# Altium schematic sheet MCU.SchDoc
size Legal; CompanyName: Ploopy Corporation; Organization: Ploopy Corporation; Address1: 137-1140 Burnhamthorpe Road W; Address2: Mississauga; Address3: Ontario; Address4: Canada L5C 0A3; DocumentNumber: 3; Revision: R1.001; SheetNumber: 3; SheetTotal: 5
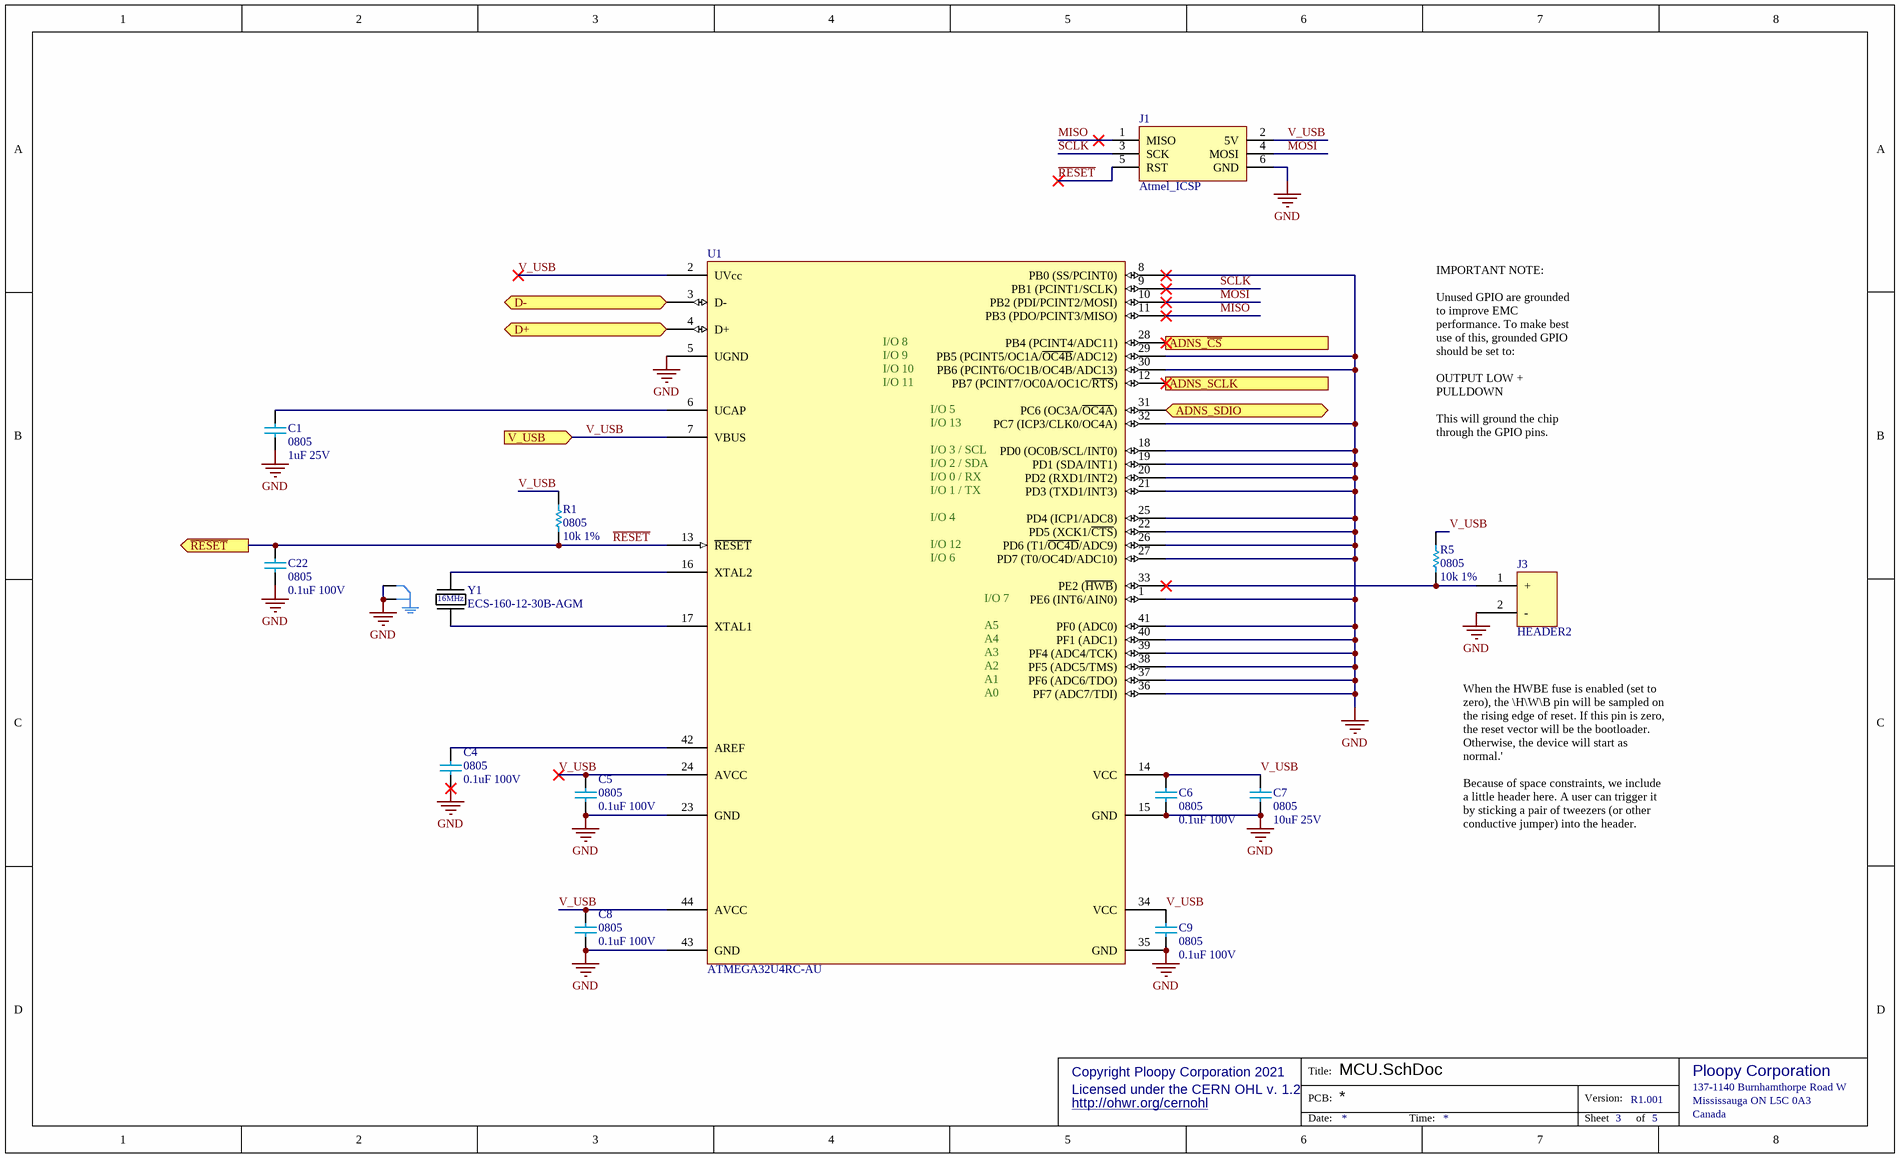
[diagram p0: MCU.SchDoc]

## Parts
C1  0805  value 1uF 25V  [0805 - TALL]
C4  0805  value 0.1uF 100V  [0805 - TALL]
C5  0805  value 0.1uF 100V  [0805 - TALL]
C6  0805  value 0.1uF 100V  [0805 - TALL]
C7  0805  value 10uF 25V  [0805 - TALL]
C8  0805  value 0.1uF 100V  [0805 - TALL]
C9  0805  value 0.1uF 100V  [0805 - TALL]
C22  0805  value 0.1uF 100V  [0805 - TALL]
J1  Atmel_ICSP  [6x2]
J3  HEADER2  [2x1]
R1  0805  value 10k 1%  [0805]
R5  0805  value 10k 1%  [0805]
U1  ATMEGA32U4RC-AU  [ATmega32U4 - TQFP80P1200X1200X120-44N]
Y1  ECS-160-12-30B-AGM  [LFXTAL055663BULK]

## Ports
ADNS_SCLK (out), ADNS_SDIO (bidir), ADNS_~{CS} (out), D+ (bidir), D- (bidir), V_USB (in), ~{RESET} (out)

## Nets
GND: C1.1 C4.1 C5.1 C6.1 C7.1 C8.1 C9.1 C22.1 J1.6(GND) J3.2(-) U1.1(PE6_(INT6/AIN0)) U1.5(UGND) U1.8(PB0_(SS/PCINT0)) U1.15(GND) U1.18(PD0_(OC0B/SCL/INT0)) U1.19(PD1_(SDA/INT1)) U1.20(PD2_(RXD1/INT2)) U1.21(PD3_(TXD1/INT3)) U1.22(PD5_(XCK1/~{CTS})) U1.23(GND) U1.25(PD4_(ICP1/ADC8)) U1.26(PD6_(T1/~{OC4D}/ADC9)) U1.27(PD7_(T0/OC4D/ADC10)) U1.29(PB5_(PCINT5/OC1A/~{OC4B}/ADC12)) U1.30(PB6_(PCINT6/OC1B/OC4B/ADC13)) U1.32(PC7_(ICP3/CLK0/OC4A)) U1.35(GND) U1.36(PF7_(ADC7/TDI)) U1.37(PF6_(ADC6/TDO)) U1.38(PF5_(ADC5/TMS)) U1.39(PF4_(ADC4/TCK)) U1.40(PF1_(ADC1)) U1.41(PF0_(ADC0)) U1.43(GND) Y1.2 Y1.4
ADNS_~{CS}: U1.28(PB4_(PCINT4/ADC11)) ; port ADNS_~{CS}
ADNS_SCLK: U1.12(PB7_(PCINT7/OC0A/OC1C/~{RTS})) ; port ADNS_SCLK
ADNS_SDIO: U1.31(PC6_(OC3A/~{OC4A})) ; port ADNS_SDIO
D+: U1.4(D+) ; port D+
D-: U1.3(D-) ; port D-
MISO: J1.1(MISO) U1.11(PB3_(PDO/PCINT3/MISO))
MOSI: J1.4(MOSI) U1.10(PB2_(PDI/PCINT2/MOSI))
~{RESET}: C22.2 J1.5(RST) R1.1 U1.13(~{RESET}) ; port ~{RESET}
SCLK: J1.3(SCK) U1.9(PB1_(PCINT1/SCLK))
V_USB: C5.2 C6.2 C7.2 C8.2 C9.2 J1.2(5V) R1.2 R5.2 U1.2(UVcc) U1.7(VBUS) U1.14(VCC) U1.24(AVCC) U1.34(VCC) U1.44(AVCC) ; port V_USB
NetC1_2: C1.2 U1.6(UCAP)
NetC4_2: C4.2 U1.42(AREF)
NetJ3_1: J3.1(+) R5.1 U1.33(PE2_(~{HWB}))
NetU1_16: U1.16(XTAL2) Y1.1
NetU1_17: U1.17(XTAL1) Y1.3

## Notes on the sheet
- IMPORTANT NOTE:
  Unused GPIO are grounded to improve EMC performance. To make best use of this, grounded GPIO should be set to:
  OUTPUT LOW + PULLDOWN
  This will ground the chip through the GPIO pins.
- When the HWBE fuse is enabled (set to zero), the \H\W\B pin will be sampled on the rising edge of reset. If this pin is zero, the reset vector will be the bootloader. Otherwise, the device will start as normal.'
  Because of space constraints, we include a little header here. A user can trigger it by sticking a pair of tweezers (or other conductive jumper) into the header.
- Copyright Ploopy Corporation 2021
- Licensed under the CERN OHL v. 1.2
- http://ohwr.org/cernohl
- Title:
- PCB:
- Version:
- Ploopy Corporation
- Mississauga ON L5C 0A3
- 137-1140 Burnhamthorpe Road W
- Date:
- Time:
- Sheet
- of
- Canada
- (in symbol ATMEGA32U4RC-AU) I/O 8; I/O 9; I/O 10; I/O 11; I/O 5; I/O 13; I/O 3 / SCL; I/O 2 / SDA; I/O 0 / RX; I/O 1 / TX; I/O 4; I/O 12; I/O 6; I/O 7; A5; A4; A3; A2; A1; A0
- (in symbol ECS-160-12-30B-AGM) 16MHz

## Library data of the parts
C1 = Cap 1uF 25V: 0805, X5R or better; Supplier 1: Digi-Key; Supplier Part Number 1: 1276-1066-2-ND; Supplier 2: Digi-Key; Supplier Part Number 2: 1276-1066-1-ND
C4-C6 C8 C9 C22 = Cap 0.1uF 100V: 0805, X5R or better; Supplier 1: Digi-Key; Supplier Part Number 1: 1276-6840-2-ND
C7 = Cap 10uF 25V: 0805, X5R or better; Supplier 1: Mouser; Supplier Part Number 1: 81-GRM21BR61E106KA3L; Supplier 2: Digi-Key; Supplier Part Number 2: 490-5523-1-ND
J1 = Atmel_ICSP: 6-pin 0.100" ICSP header; Supplier 1: Digi-Key; Supplier Part Number 1: S2012EC-03-ND
J3 = HEADER2: 2-pin 0.100" header; Supplier 1: Mouser; Supplier Part Number 1: 855-M20-9990245; Supplier 2: Digi-Key; Supplier Part Number 2: 952-2261-ND
R1 R5 = Res 10k 1% 0805: Chip resistor; Supplier 1: Digi-Key; Supplier Part Number 1: RMCF0805FT10K0TR-ND
U1 = ATMEGA32U4RC-AU: IC MCU 8BIT 32KB FLASH 44TQFP; PNP-Nzl: 6; PNP-dx: 0; PNP-X: 12; PNP-A: 270; PNP-Pt: 1; PNP-W: 0.1; PNP-Thk: 1.6; PNP-Lv: 126; PNP-TS: 70; PNP-Level: 1.2; PNP-Type: QFP; PNP-FeedType: Tray; PNP-PlacePriority: 3; PNP-dy: 0; PNP-Y: 12; PNP-Voff: 0; PNP-da: 0; Supplier 1: Digi-Key; Supplier 2: Mouser; Supplier 3: Arrow; Supplier Part Number 1: ATMEGA32U4RC-AU-ND; Supplier Part Number 2: 556-ATMEGA32U4RC-AU; Supplier Part Number 3: ATMEGA32U4RC-AU
Y1 = ECS-160-12-30B-AGM: 16MHz Crystal 12pF 100 Ohms 4-SMD, No Lead; Supplier 1: Digi-Key; Supplier 2: Mouser; Supplier Part Number 1: XC2686CT-ND; Supplier Part Number 2: 520-160-12-30B-AGMT